# Altium schematic sheet Thermostat_EEM_Breakout.SchDoc: Thermostat EEM
size 420 x 297 mm; DocumentNumber: 6; SheetNumber: 6; SheetTotal: 9; ModifiedBy: -; CheckedDate: -; Title2: Breakout board; DivGrp: WUT ISE; Designer: G.Kasprowicz
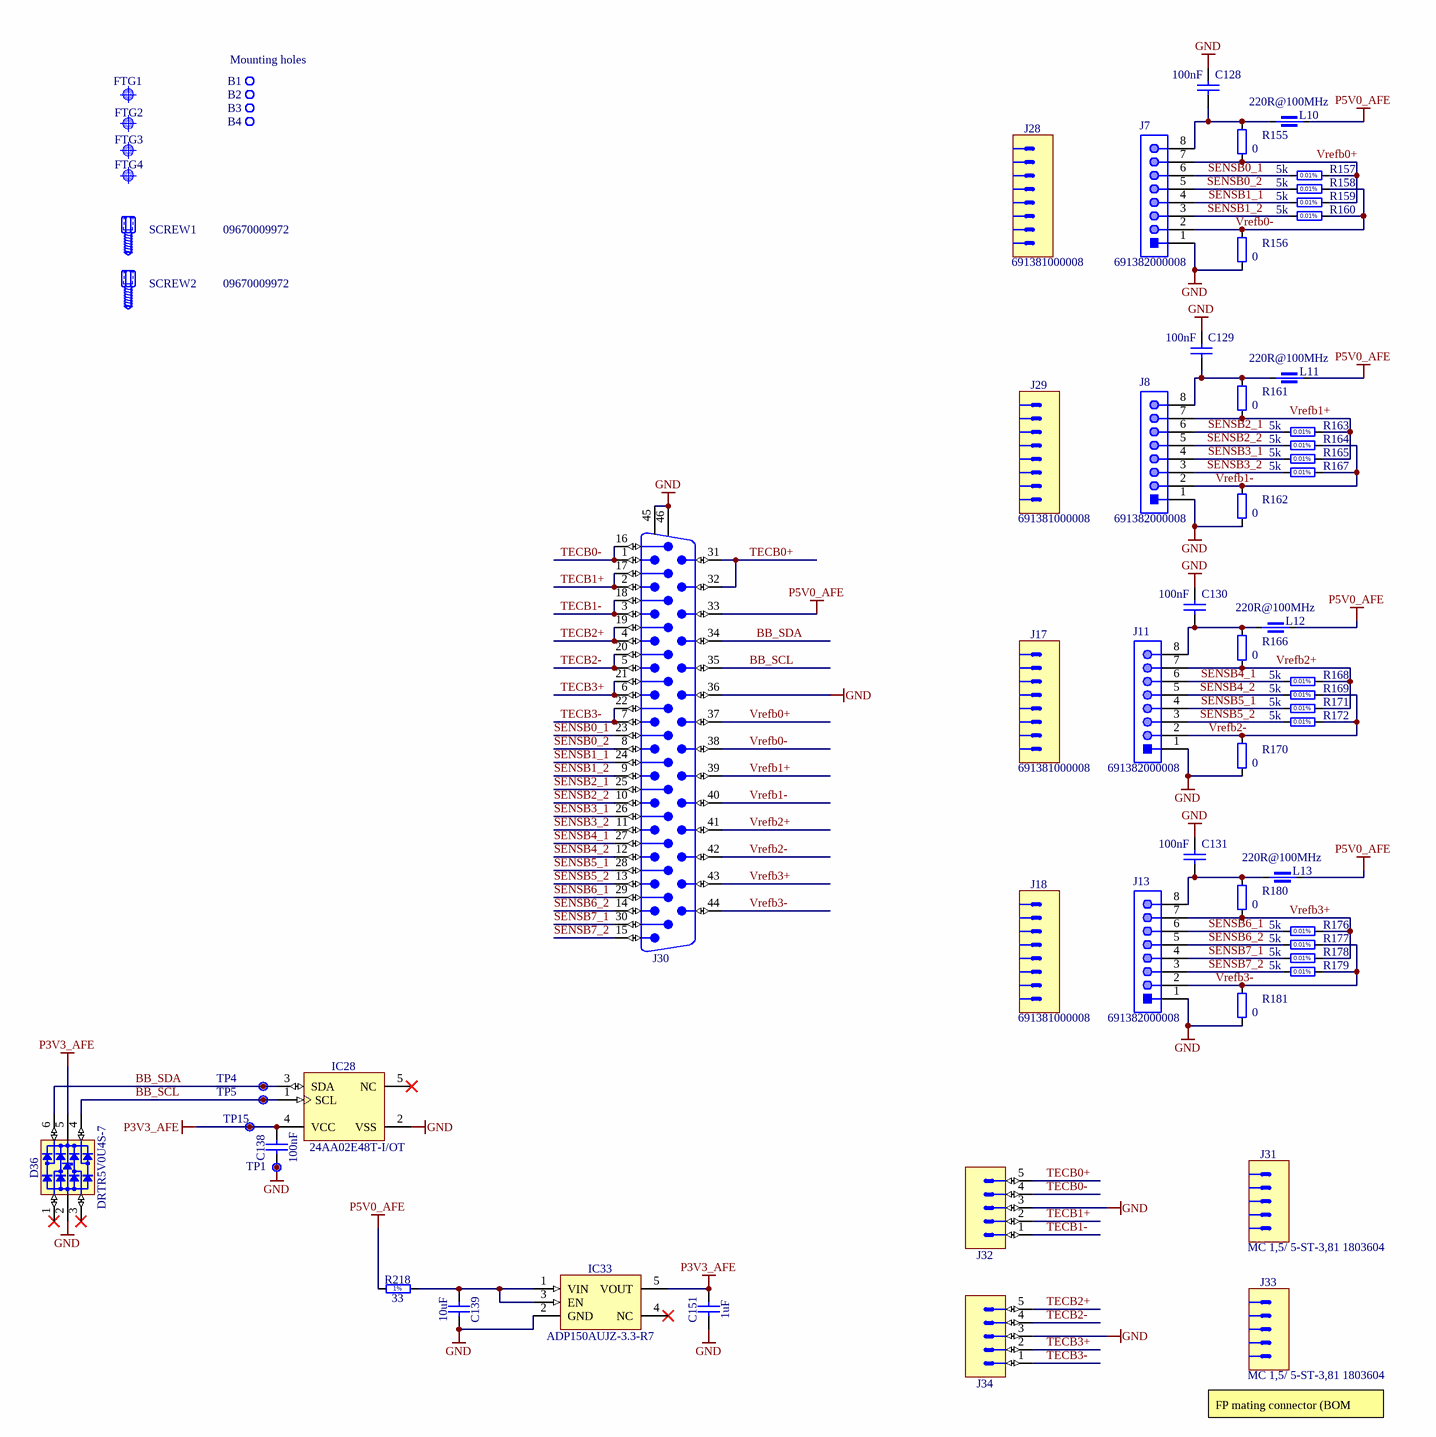
[diagram p0: Thermostat_EEM_Breakout.SchDoc]

## Parts
B1  Plated Hole  [MTG320_550]  (value not drawn)  (no BOM)
B2  Plated Hole  [MTG320_550]  (value not drawn)  (no BOM)
B3  Plated Hole  [MTG320_550]  (value not drawn)  (no BOM)
B4  Plated Hole  [MTG320_550]  (value not drawn)  (no BOM)
C128  100nF  [CAPC1005X55N]
C129  100nF  [CAPC1005X55N]
C130  100nF  [CAPC1005X55N]
C131  100nF  [CAPC1005X55N]
C138  100nF  [CAPC1005X55N]
C139  10uF  [CAPC2012X135N]
C151  1uF  [CAPC1608X87N]
D36  DRTR5V0U4S-7  [SOT65P210X110-6N]
FTG1  Use only in PCB  [FIDUCIAL_TOP_S100-200]  (value not drawn)  (no BOM)
FTG2  Use only in PCB  [FIDUCIAL_TOP_S100-200]  (value not drawn)  (no BOM)
FTG3  Use only in PCB  [FIDUCIAL_TOP_S100-200]  (value not drawn)  (no BOM)
FTG4  Use only in PCB  [FIDUCIAL_TOP_S100-200]  (value not drawn)  (no BOM)
IC28  24AA02E48T-I/OT  [SOT95P280X145-5N]
IC33  ADP150AUJZ-3.3-R7  [SOT95P280X90-5N]
J7  691382000008  [691382000008]
J8  691382000008  [691382000008]
J11  691382000008  [691382000008]
J13  691382000008  [691382000008]
J17  691381000008  [WURTH_691381000008]
J18  691381000008  [WURTH_691381000008]
J28  691381000008  [WURTH_691381000008]
J29  691381000008  [WURTH_691381000008]
J30  D-Sub  [AMPHENOL_10090926-P444XLF]  (value not drawn)
J31  Manufacturer Part Number: MC 1,5/ 5-ST-3,81 1803604  [PHOENIX_1803604]
J32  (no value)  [PHOENIX_1803455]
J33  Manufacturer Part Number: MC 1,5/ 5-ST-3,81 1803604  [PHOENIX_1803604]
J34  (no value)  [PHOENIX_1803455]
L10  220R@100MHz  [INDC1005X55N]
L11  220R@100MHz  [INDC1005X55N]
L12  220R@100MHz  [INDC1005X55N]
L13  220R@100MHz  [INDC1005X55N]
R155  0  [RESC1608X55N]
R156  0  [RESC1608X55N]
R157  5k  [RESC2013X64N]
R158  5k  [RESC2013X64N]
R159  5k  [RESC2013X64N]
R160  5k  [RESC2013X64N]
R161  0  [RESC1608X55N]
R162  0  [RESC1608X55N]
R163  5k  [RESC2013X64N]
R164  5k  [RESC2013X64N]
R165  5k  [RESC2013X64N]
R166  0  [RESC1608X55N]
R167  5k  [RESC2013X64N]
R168  5k  [RESC2013X64N]
R169  5k  [RESC2013X64N]
R170  0  [RESC1608X55N]
R171  5k  [RESC2013X64N]
R172  5k  [RESC2013X64N]
R176  5k  [RESC2013X64N]
R177  5k  [RESC2013X64N]
R178  5k  [RESC2013X64N]
R179  5k  [RESC2013X64N]
R180  0  [RESC1608X55N]
R181  0  [RESC1608X55N]
R218  33  [RESC1005X40N]
SCREW1  09670009972  [3M_3341-31]
SCREW2  09670009972  [3M_3341-31]
TP1  Test Point  [TPS127]  (value not drawn)
TP4  Test Point  [TPS127]  (value not drawn)
TP5  Test Point  [TPS127]  (value not drawn)
TP15  Test Point  [TPS127]  (value not drawn)

## Nets
GND: C128.1 C129.1 C130.1 C131.1 C138.1 C139.2 C151.1 D36.2(GND) IC28.2(VSS) IC33.2(GND) J7.1 J8.1 J11.1 J13.1 J30.36 J30.45 J30.46 J32.3 J34.3 R156.1 R162.1 R170.1 R181.1 TP1.1
P3V3_AFE: C138.2 C151.2 D36.5(VBUS) IC28.4(VCC) IC33.5(VOUT) TP15.1
P5V0_AFE: J30.33 L10.2 L11.2 L12.2 L13.2 R218.1
BB_SCL: D36.4(I/O3) IC28.1(SCL) J30.35 TP5.1
BB_SDA: D36.6(I/O4) IC28.3(SDA) J30.34 TP4.1
SENSB0_1: J7.6 J30.23 R157.1
SENSB0_2: J7.5 J30.8 R158.1
SENSB1_1: J7.4 J30.24 R159.1
SENSB1_2: J7.3 J30.9 R160.1
SENSB2_1: J8.6 J30.25 R163.1
SENSB2_2: J8.5 J30.10 R164.1
SENSB3_1: J8.4 J30.26 R165.1
SENSB3_2: J8.3 J30.11 R167.1
SENSB4_1: J11.6 J30.27 R168.1
SENSB4_2: J11.5 J30.12 R169.1
SENSB5_1: J11.4 J30.28 R171.1
SENSB5_2: J11.3 J30.13 R172.1
SENSB6_1: J13.6 J30.29 R176.1
SENSB6_2: J13.5 J30.14 R177.1
SENSB7_1: J13.4 J30.30 R178.1
SENSB7_2: J13.3 J30.15 R179.1
TECB0+: J30.31 J30.32 J32.5
TECB0-: J30.1 J30.16 J32.4
TECB1+: J30.2 J30.17 J32.2
TECB1-: J30.3 J30.18 J32.1
TECB2+: J30.4 J30.19 J34.5
TECB2-: J30.5 J30.20 J34.4
TECB3+: J30.6 J30.21 J34.2
TECB3-: J30.7 J30.22 J34.1
Vrefb0+: J7.7 J30.37 R155.1 R157.2 R159.2
Vrefb0-: J7.2 J30.38 R156.2 R158.2 R160.2
Vrefb1+: J8.7 J30.39 R161.1 R163.2 R165.2
Vrefb1-: J8.2 J30.40 R162.2 R164.2 R167.2
Vrefb2+: J11.7 J30.41 R166.1 R168.2 R171.2
Vrefb2-: J11.2 J30.42 R169.2 R170.2 R172.2
Vrefb3+: J13.7 J30.43 R176.2 R178.2 R180.1
Vrefb3-: J13.2 J30.44 R177.2 R179.2 R181.2
NetC128_2: C128.2 J7.8 L10.1 R155.2
NetC129_2: C129.2 J8.8 L11.1 R161.2
NetC130_2: C130.2 J11.8 L12.1 R166.2
NetC131_2: C131.2 J13.8 L13.1 R180.2
NetC139_1: C139.1 IC33.1(VIN) IC33.3(EN) R218.2

Not connected (* = marked no-connect by the designer): B1 1; B2 1; B3 1; B4 1; D36 1(I/O1)* 3(I/O2)*; IC28 5(NC)*; IC33 4(NC)*

## Notes on the sheet
- (near B1) Mounting holes
- FP mating connector (BOM only)
- Project/Equipment
- Document
- Designer
- Drawn by
- Check.by
- Copyright WUT ISE 2024.
  This documentation describes Open Hardware and is licensed under the CERN OHL-W v.2.0. You may redistribute and modify this documentation under the terms of the CERN OHL-W v.2.0. (http://ohwr.org/CERNOHL). This documentation is distributed WITHOUT ANY EXPRESS OR IMPLIED WARRANTY, INCLUDING OF MERCHANTABILITY, SATISFACTORY QUALITY AND FITNESS FOR A PARTICULAR PURPOSE. Please see the CERN OHL v.2.0 for applicable conditions.
- Contact
- File
- Last Mod.
- Print Date
- Sheet
- Size
- A3
- of
- Rev
- (in symbol R0402_33R_1%_0.0625W_100PPM) 1%
- (in symbol R0805_5K_0.01%_0.2W_0.2PPM_VISHAY_VSMP) 0.01%

## Library data of the parts
B1-B4 = PLATED_HOLE3.2_PAD5.5: Single Terminal Socket; Part Description: Plated Through Hole: Hole Dia.=3.2mm Pad Dia.=5.5mm; Mounted: No; Part Number: PLATED_HOLE3.2_PAD5.5; Component Type: Standard (No BOM); Pin Count: 1; Family: Plated Hole; Socket: No; SMD: No; Sense: No; Status: None; ComponentHeight: 0mm; HelpURL: Undefined; Author: CERN DEM JMW; CreateDate: 01.10.2012; LatestRevisionDate: 01.10.2012; PackageDescription: Plated Through Hole: Hole Dia.=3.2mm Pad Dia.=5.5mm
C128-C131 C138 = CC0402_100NF_16V_10%_X5R: Non-polarised capacitor; Part Description: SMD Multilayer Chip Ceramic Capacitor; Manufacturer: GENERIC; Manufacturer1 Part Number: GRM155R61C104KA88D; Voltage: 16V; TC: X5R; Tolerance: ±10%; Part Number: CC0402_100NF_16V_10%_X5R; Component Kind: Standard; Component Type: Standard; Pin Count: 2; Value: 100nF; Status: None; Manufacturer Part Number: CC0402_100NF_16V_10%_X5R; Case: 0402; Mounted: Yes; Socket: No; SMD: Yes; Sense: No; Manufacturer1 Example: MURATA; Manufacturer1 ComponentHeight: 0.55mm; HelpURL: \\cern.ch\dfs\Applications\Altium\Datasheets\CC0402_X5R_MURATA_GRM.pdf; Author: CERN DEM JLC; CreateDate: 10.12.2013; LatestRevisionDate: 10.12.2013
C139 = CC0805_10UF_16V_10%_X5R: Non-polarised capacitor; Part Description: SMD Multilayer Chip Ceramic Capacitor; Manufacturer: GENERIC; Manufacturer1 Part Number: C0805C106K4PAC; Voltage: 16V; TC: X5R; Tolerance: ±10%; Part Number: CC0805_10UF_16V_10%_X5R; Component Kind: Standard; Component Type: Standard; Pin Count: 2; Value: 10uF; Status: Preferred; Manufacturer Part Number: CC0805_10UF_16V_10%_X5R; Case: 0805; Mounted: Yes; Socket: No; SMD: Yes; Manufacturer1 Example: KEMET; Manufacturer1 ComponentHeight: 1.4mm; HelpURL: \\cern.ch\dfs\Applications\Altium\Datasheets\CC1206_X5R_KEMET.pdf; Author: CERN DEM JLC; CreateDate: 03.12.2007; LatestRevisionDate: 03.12.2007; Sense: No
C151 = CC0603_1UF_25V_10%_X7R: Non-polarised capacitor; Part Description: SMD Multilayer Chip Ceramic Capacitor; Manufacturer: GENERIC; Manufacturer1 Part Number: GRM188R71E105KA12D; Voltage: 25V; TC: X7R; Tolerance: ±10%; Part Number: CC0603_1UF_25V_10%_X7R; Component Kind: Standard; Component Type: Standard; Pin Count: 2; Value: 1uF; Status: None; Manufacturer Part Number: CC0603_1UF_25V_10%_X7R; Case: 0603; Mounted: Yes; Socket: No; SMD: Yes; Sense: No; Manufacturer1 Example: MURATA; Manufacturer1 ComponentHeight: 0.9mm; HelpURL: \\cern.ch\dfs\Applications\Altium\Datasheets\CC0603_X7R_MURATA.pdf; Author: CERN DEM JLC; CreateDate: 18/01/2011; LatestRevisionDate: 18/01/2011
D36 = D_TVS_DRTR5V0U4S-7: Integrated Quad Ultra-Low Capacitance ESD Protection; Part Description: Integrated Quad Ultra-Low Capacitance ESD (±8kV) Protection; Manufacturer: DIODES; PressFit: No; Bonding: No; Status Comment: Active; Part Number: DRTR5V0U4S-7; Component Kind: Standard; Component Type: Standard; Device: DRTR5V0U4S-7; PackageDescription: SOT363, SC70-6, 0.65mm Pitch; 6 Pin, 1.25mm W X 2.00mm L X 1.10mm H body, IPC Medium Density; Status: Active; Manufacturer Part Number: DRTR5V0U4S-7; Pin Count: 6; Case: SOT363; Mounted: Yes; Socket: No; SMD: Yes; Sense: No; ComponentHeight: 1.1mm; HelpURL: \\cern.ch\dfs\Applications\Altium\Datasheets\PRTR5V0U4Y.pdf; Author: GK; CreateDate: 24.01.2017; LatestRevisionDate: 14.09.2020
FTG1-FTG4 = FIDUCIAL_TARGET_S100-200: Fiducial Target; Part Description: Square Fiducial Target, Top Layer, 1.0mm, Top Solder 2.0mm, Keepout =2.0mm; Mounted: No; Part Number: FIDUCIAL_TARGET_S100-200; Component Type: Standard (No BOM); Pin Count: 1; Family: Fiducial; Socket: No; SMD: Yes; Sense: No; Status: None; ComponentHeight: 0mm; HelpURL: Undefined; Author: CERN DEM JLC; CreateDate: 09.02.2010; LatestRevisionDate: 04.04.2012; PackageDescription: Square Fiducial Target, Top Layer, 1.0mm, Top Solder 2.0mm, Keepout =2.0mm
IC28 = 24AA02E48T-I/OT: 1.7V-5.5V, 2K I2C Serial EEPROM With EUI-48 Node Identity; Manufacturer: MICROCHIP TECHNOLOGY; PressFit: No; Bonding: No; Part Number: 24AA02E48T-I/OT; Component Kind: Standard; Component Type: Standard; Device: 24AA02E48T-I/OT; PackageDescription: SOT, 0.95mm pitch; 5 pin, 1.60mm W X 2.90mm L X 1.45mm H body, IPC Medium Density; Part Description: 1.7V-5.5V, 2K I2C Serial EEPROM With EUI-48 Node Identity; Manufacturer Part Number: 24AA02E48T-I/OT; Pin Count: 5; Case: SOT23-5; Mounted: Yes; Socket: No; SMD: Yes; Sense: No; ComponentHeight: 1.45mm; HelpURL: \\cern.ch\dfs\Applications\Altium\Datasheets\24AA02E48T-I-OT.pdf; Author: CERN DEM MR; CreateDate: 31.03.2016; LatestRevisionDate: 31.03.2016
IC33 = ADP150AUJZ-3.3-R7: Ultralow Noise, 150 mA CMOS Linear Regulator; Part Description: 3.3V, 150mA, Ultralow Noise, CMOS Linear Regulator; Manufacturer: ANALOG DEVICES; PressFit: No; Bonding: No; Part Number: ADP150AUJZ-3.3-R7; Component Kind: Standard; Component Type: Standard; Device: ADP150AUJZ-3.3-R7; PackageDescription: SOT23, 0.95mm pitch; 5 pin, 1.75mm W X 3.00mm L, IPC Medium Density; Manufacturer Part Number: ADP150AUJZ-3.3-R7; Pin Count: 5; Case: SOT23; Mounted: Yes; Socket: No; SMD: Yes; Sense: No; ComponentHeight: 0.9mm; HelpURL: \\cern.ch\dfs\Applications\Altium\Datasheets\ADP150AUJZ-3.3-R7.pdf; Author: CERN DEM JLC; CreateDate: 27/09/2011; LatestRevisionDate: 19/06/2014
J7 J8 J11 J13 = 691382000008: WR-TBL Serie 382 Vertical PCB Header, Pluggable, pitch 2.5mm, 8p; Compliance: RoHS; Modularity: No; Pin Number: 8; Rated Current [UL]: 12A; Working Voltage [UL]: 300VAC; ComponentLink1Description: Manufacturer; ComponentLink1URL: http://www.we-online.de; ComponentLink2URL: https://katalog.we-online.de/em/datasheet/691382000008.pdf; ComponentLink2Description: Datasheet; Mounting Technology: THT; Manufacturer Part Number: 691382000008; Packaging: Box; Operating Temperature: -40 to +105degC; PCB/Cable/Panel: PCB; Pitch: 2.5mm; Published Date: October 2019; Type: Vertical; Publisher: Wurth Elektronik; Application: Pluggable
J17 J18 J28 J29 = CON_TB_WURTH_691381000008: Phoenix Contact 2.5 pitch terminal plug, 8 ways; Manufacturer: WURTH; Manufacturer Part Number: 691381000008
J30 = AMPHENOL_10090926-P444XLF: Connector D-sub 44 Male; Part Description: Right Angle High Density D-sub 44 Male Contacts with Harpoons + UNC 4-40 Clinchnuts + Electrical Continuity; PressFit: No; Part Number: AMPHENOL_10090926-P444XLF; Component Kind: Standard; Component Type: Standard; Pin Count: 46; Family: D-Sub; Mounted: Yes; Socket: No; SMD: No; Sense: No; Status: None; Manufacturer: AMPHENOL; Manufacturer Part Number: 10090926-P444XLF; ComponentHeight: 12.8mm; HelpURL: \\cern.ch\dfs\Applications\Altium\Datasheets\AMPHENOL_10090926-P444XLF.pdf; Author: CERN DEM BC; CreateDate: 22.10.2020; LatestRevisionDate: 22.10.2020
J31 J33 = PHOENIX_1803604: Phoenix Contact 3.81 pitch terminal plug, 5 ways; Mates with: PHOENIX_1803303; Manufacturer: Phoenix Contact
J32 J34 = PHOENIX_1803455: Connector 5 Male; Part Description: 8A 160 V, Pitch: 3.81mm, 5 Positions Header; Manufacturer: PHOENIX CONTACT; Manufacturer Part Number: 1803455 (MCV 1,5/ 5-G-3,81); PressFit: No; Part Number: PHOENIX_1803455; Component Kind: Standard; Component Type: Standard; Pin Count: 5; Mounted: Yes; Socket: No; SMD: No; Sense: No; Status: None; ComponentHeight: 9.2mm; HelpURL: \\cern.ch\dfs\Applications\Altium\Datasheets\PHOENIX_1803455.pdf; Author: CERN DEM JLC; CreateDate: 04.11.2013; LatestRevisionDate: 04.11.2013
L10-L13 = IND0402_MURATA_BLM15HB221SN1: Part Description: SMD EMIFIL Suppression Chip Ferrite Bead; Manufacturer: MURATA; Power: 250mA; Resistance: 1R; Tolerance: ±25%; Part Number: IND0402_MURATA_BLM15HB221SN1; Component Kind: Standard; Component Type: Standard; Pin Count: 2; Value: 220R@100MHz; Status: None; Manufacturer Part Number: BLM15HB221SN1; Case: 0402; Mounted: Yes; Socket: No; SMD: Yes; Sense: No; ComponentHeight: 0.55mm; HelpURL: \\cern.ch\dfs\Applications\Altium\Datasheets\IND0402_MURATA_BLM15H.pdf; Author: CERN DEM JLC; CreateDate: 23.06.2009; LatestRevisionDate: 25.10.2018
R155 R156 R161 R162 R166 R170 R180 R181 = R0603_0R_JUMPER: Resistor; Part Description: 1A (0.05R Max DC Resistance) Zero Ohm Jumper; Manufacturer: GENERIC; Manufacturer1 Part Number: NRC06Z0; PressFit: No; Part Number: R0603_0R_JUMPER; Component Kind: Standard; Component Type: Standard; Pin Count: 2; Value: 0; Status: Preferred; Manufacturer Part Number: R0603_0R_JUMPER; Case: 0603; Mounted: Yes; Sense: No; Socket: No; SMD: Yes; Manufacturer1 Example: NIC COMPONENT; Manufacturer1 ComponentHeight: 0.55mm; HelpURL: \\cern.ch\dfs\Applications\Altium\Datasheets\R0603_NIC_NRC.pdf; Author: CERN DEM JLC; CreateDate: 03.12.2007; LatestRevisionDate: 13.03.2008
R157-R160 R163-R165 R167-R169 R171 R172 R176-R179 = R0805_5K_0.01%_0.2W_0.2PPM_VISHAY_VSMP: Resistor - 0.01%; Part Description: Ultra High Precision Foil Wraparound Surface Mount Chip Resistor; Manufacturer: VISHAY PRECISION; Manufacturer Part Number: Y16245K00000T9R; Power: 0.2W; TC: ±0.2ppm/°C; PressFit: No; Part Number: R0805_5K_0.01%_0.2W_0.2PPM_VISHAY_VSMP; Component Kind: Standard; Component Type: Standard; Pin Count: 2; Value: 5k; Status: None; Tolerance: ±0.01%; Case: 0805; Mounted: Yes; Sense: No; Socket: No; SMD: Yes; Manufacturer1 ComponentHeight: 0.64mm; HelpURL: \\cern.ch\dfs\Applications\Altium\Datasheets\R0805_VISHAY_VSMP.pdf; Author: CERN DEM JLC; CreateDate: 22.09.2011; LatestRevisionDate: 22.09.2011
R218 = R0402_33R_1%_0.0625W_100PPM: Resistor - 1%; Part Description: General Purpose Thick Film Chip Resistor; Manufacturer: GENERIC; Manufacturer1 Part Number: 232270673309L; TC: ±100ppm/°C; PressFit: No; Part Number: R0402_33R_1%_0.0625W_100PPM; Component Kind: Standard; Component Type: Standard; Pin Count: 2; Value: 33; Status: Not Recommended; Power: 0.0625W; Tolerance: ±1%; Manufacturer Part Number: R0402_33R_1%_0.0625W_100PPM; Case: 0402; Mounted: Yes; Sense: No; Socket: No; SMD: Yes; Manufacturer1 Example: YAGEO PHYCOMP; Manufacturer1 ComponentHeight: 0.4mm; HelpURL: \\cern.ch\dfs\Applications\Altium\Datasheets\R0402_Phycomp_RC0402.pdf; Author: CERN DEM JLC; CreateDate: 03/12/2007; LatestRevisionDate: 17/10/2012
SCREW1 SCREW2 = 3M_3341-31: Female Screw Lock; Part Description: MDR Female Screw Locks, Thread Size: M2.5; Manufacturer: HARTING; PressFit: No; Part Number: 09670009972; Component Kind: Standard; Component Type: Mechanical; Pin Count: 0; PackageDescription: MDR Female Screw Locks, Thread Size: M2.5; Mounted: Yes; Socket: No; SMD: No; Sense: No; Status: None; Value: 09670009972; Manufacturer Part Number: 09670009972; ComponentHeight: 11mm; HelpURL: \\cern.ch\dfs\Applications\Altium\Datasheets\TYCO_749087-2.pdf; Author: GK; CreateDate: 10.09.2013; LatestRevisionDate: 10.09.2013
TP1 TP4 TP5 TP15 = SMD_PAD_1.27X1.27MM: Part Description: 1.27mm x 1.27mm PCB Copper Area (SMD Test Point); Mounted: No; Part Number: SMD_PAD_1.27X1.27MM; Component Kind: Standard (No BOM); Component Type: Standard (No BOM); Pin Count: 1; Family: Test Point; Socket: No; SMD: Yes; Sense: No; Status: None; ComponentHeight: 0mm; HelpURL: Undefined; Author: CERN DEM JLC; CreateDate: 12.01.2008; LatestRevisionDate: 12.01.2008; PackageDescription: 1.27mm x 1.27mm PCB Copper Area (SMD Test Point)